# EAGLE design cypress-breakout_DL_v2 (EAGLE 6.1)
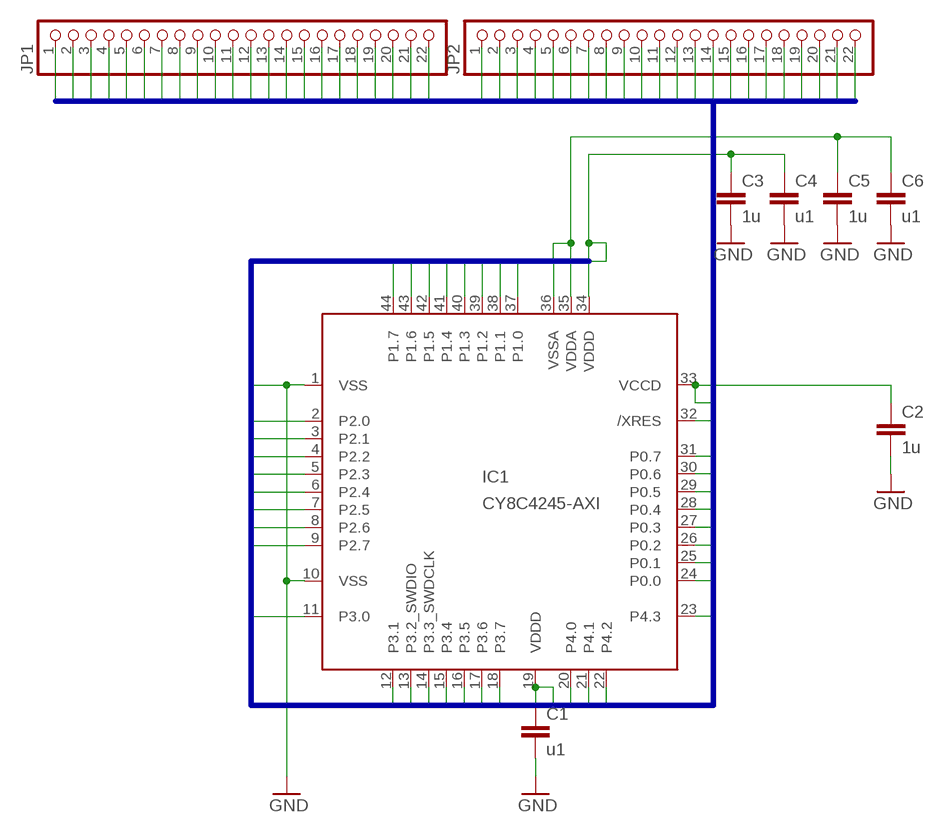
[diagram p0: schematic, sheet 1]

## Parts
C1  u1  C-EUC0805K  [C0805K]
C2  1u  C-EUC0805K  [C0805K]
C3  1u  C-EUC0805K  [C0805K]
C4  u1  C-EUC0805K  [C0805K]
C5  1u  C-EUC0805K  [C0805K]
C6  u1  C-EUC0805K  [C0805K]
IC1  CY8C4245-AXI  [44-TQFP-0.8]
JP1  PINHD-1X22  [1X22]
JP2  PINHD-1X22  [1X22]

## Nets
#XRES: IC1.32(/XRES) JP2.10
GND: C1.2 C2.2 C3.2 C4.2 C5.2 C6.2
P0.0: IC1.24(P0.0) JP2.2
P0.1: IC1.25(P0.1) JP2.3
P0.2: IC1.26(P0.2) JP2.4
P0.3: IC1.27(P0.3) JP2.5
P0.4: IC1.28(P0.4) JP2.6
P0.5: IC1.29(P0.5) JP2.7
P0.6: IC1.30(P0.6) JP2.8
P0.7: IC1.31(P0.7) JP2.9
P1.0: IC1.37(P1.0) JP2.15
P1.1: IC1.38(P1.1) JP2.16
P1.2: IC1.39(P1.2) JP2.17
P1.3: IC1.40(P1.3) JP2.18
P1.4: IC1.41(P1.4) JP2.19
P1.5: IC1.42(P1.5) JP2.20
P1.6: IC1.43(P1.6) JP2.21
P1.7: IC1.44(P1.7) JP2.22
P2.0: IC1.2(P2.0) JP1.2
P2.1: IC1.3(P2.1) JP1.3
P2.2: IC1.4(P2.2) JP1.4
P2.3: IC1.5(P2.3) JP1.5
P2.4: IC1.6(P2.4) JP1.6
P2.5: IC1.7(P2.5) JP1.7
P2.6: IC1.8(P2.6) JP1.8
P2.7: IC1.9(P2.7) JP1.9
P3.0: IC1.11(P3.0) JP1.11
P3.1: IC1.12(P3.1) JP1.12
P3.2: IC1.13(P3.2_SWDIO) JP1.13
P3.3: IC1.14(P3.3_SWDCLK) JP1.14
P3.4: IC1.15(P3.4) JP1.15
P3.5: IC1.16(P3.5) JP1.16
P3.6: IC1.17(P3.6) JP1.17
P3.7: IC1.18(P3.7) JP1.18
P4.0: IC1.20(P4.0) JP1.20
P4.1: IC1.21(P4.1) JP1.21
P4.2: IC1.22(P4.2) JP1.22
P4.3: IC1.23(P4.3) JP2.1
VCCD: C2.1 IC1.33(VCCD) JP2.11
VDDA: C5.1 C6.1 IC1.35(VDDA) JP2.13
VDDD: C1.1 C3.1 C4.1 IC1.19(VDDD) IC1.34(VDDD) JP1.19 JP2.12
VSS: IC1.1(VSS) IC1.10(VSS) JP1.1 JP1.10 ; supply symbol labelled GND
VSSA: IC1.36(VSSA) JP2.14

## Buses
P0.[0..7],P1.[0..7],P2.[0..7],P3.[0..7],P4.[0..3],VSS,VDDD,#XRES,VSSA,VDDA,VCCD

## Library data of the parts
C1-C6 = rcl:C-EU: CAPACITOR, European symbol
IC1 = CY8C4200:CY8C4245: PSOC4200 in TQFP-44 Source:
JP1 JP2 = pinhead:PINHD-1X22: PIN HEADER

## Board
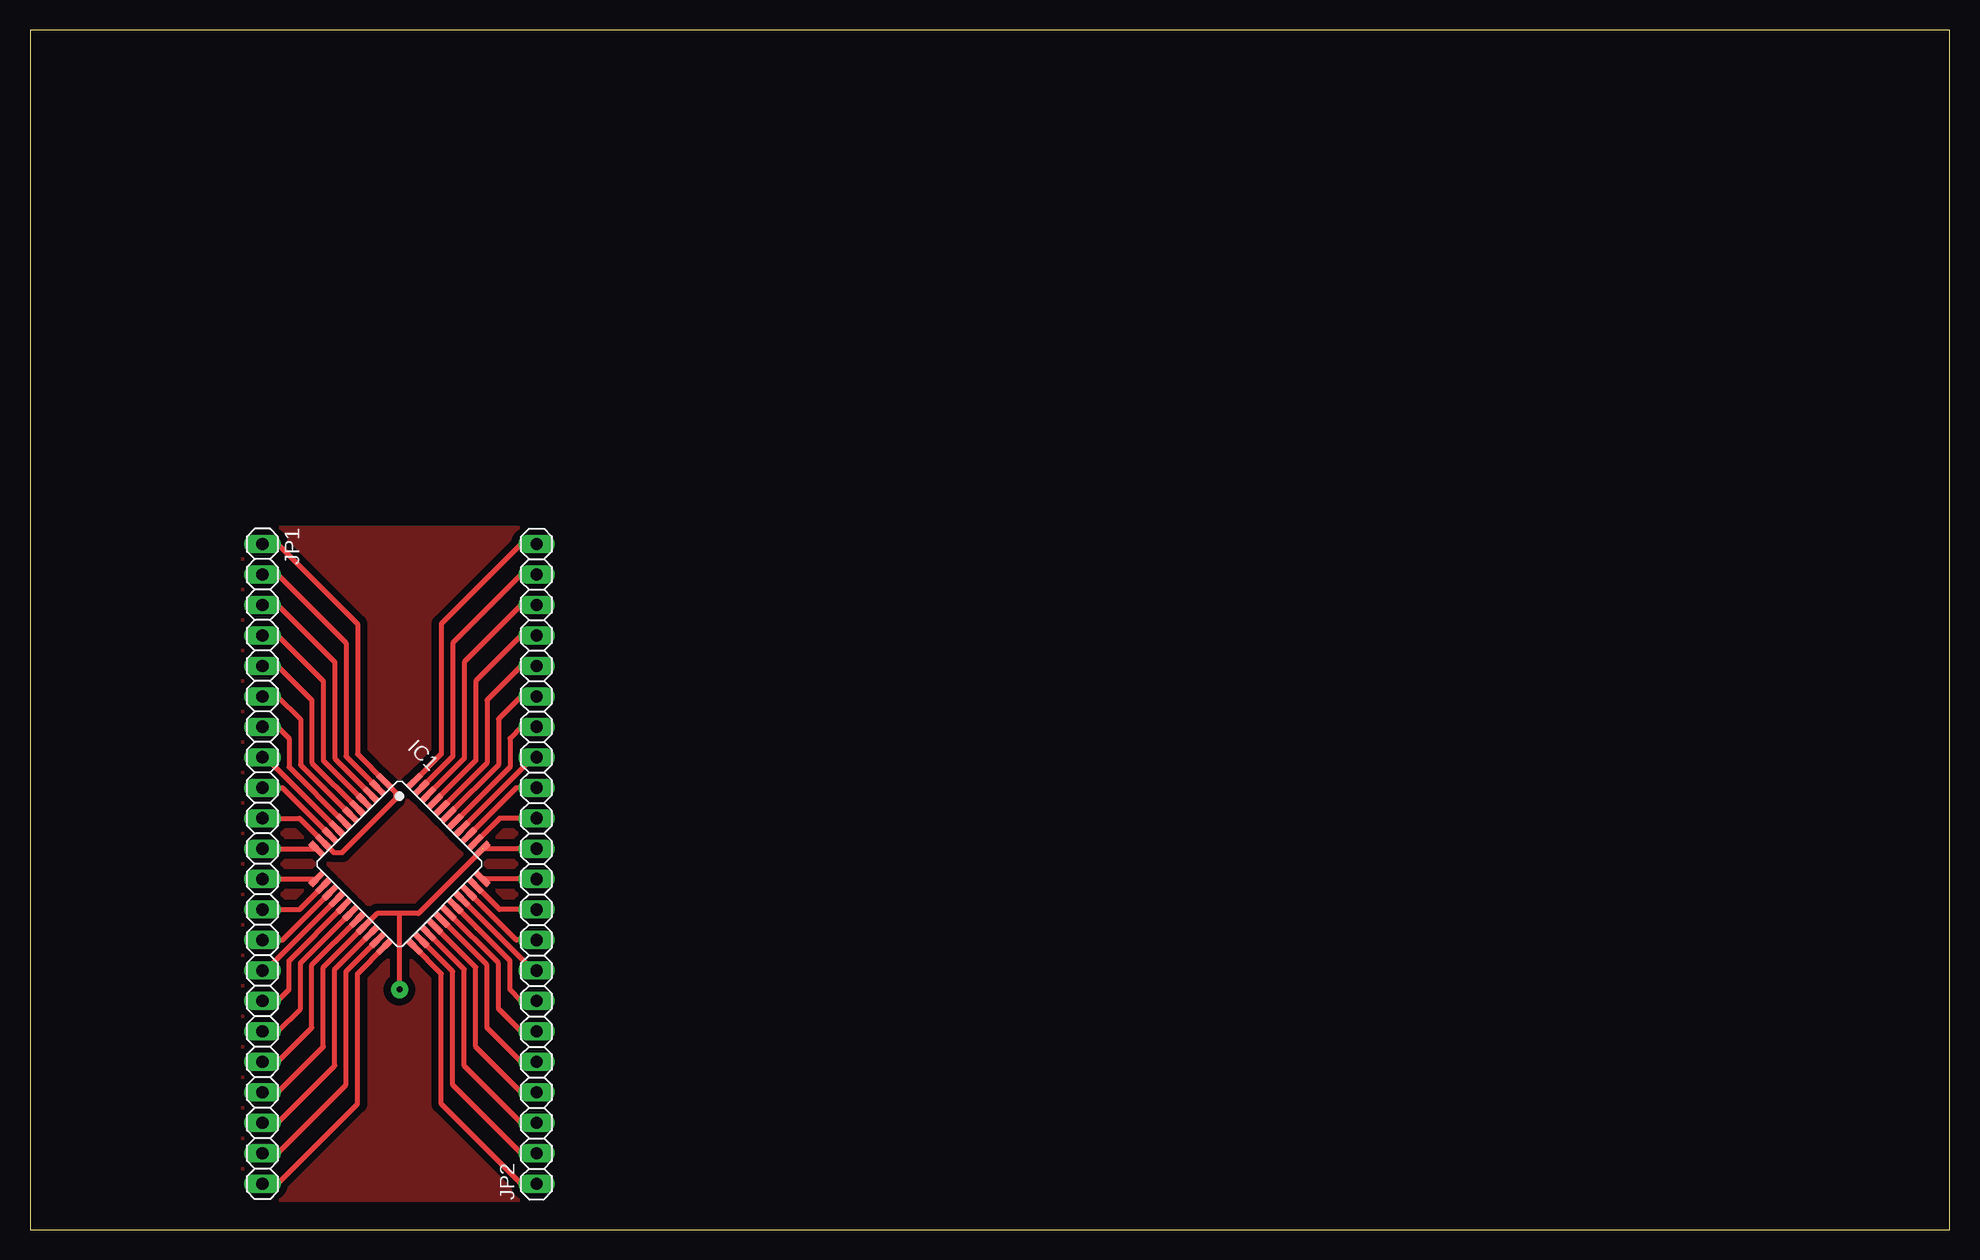
[diagram p1: board, top side]
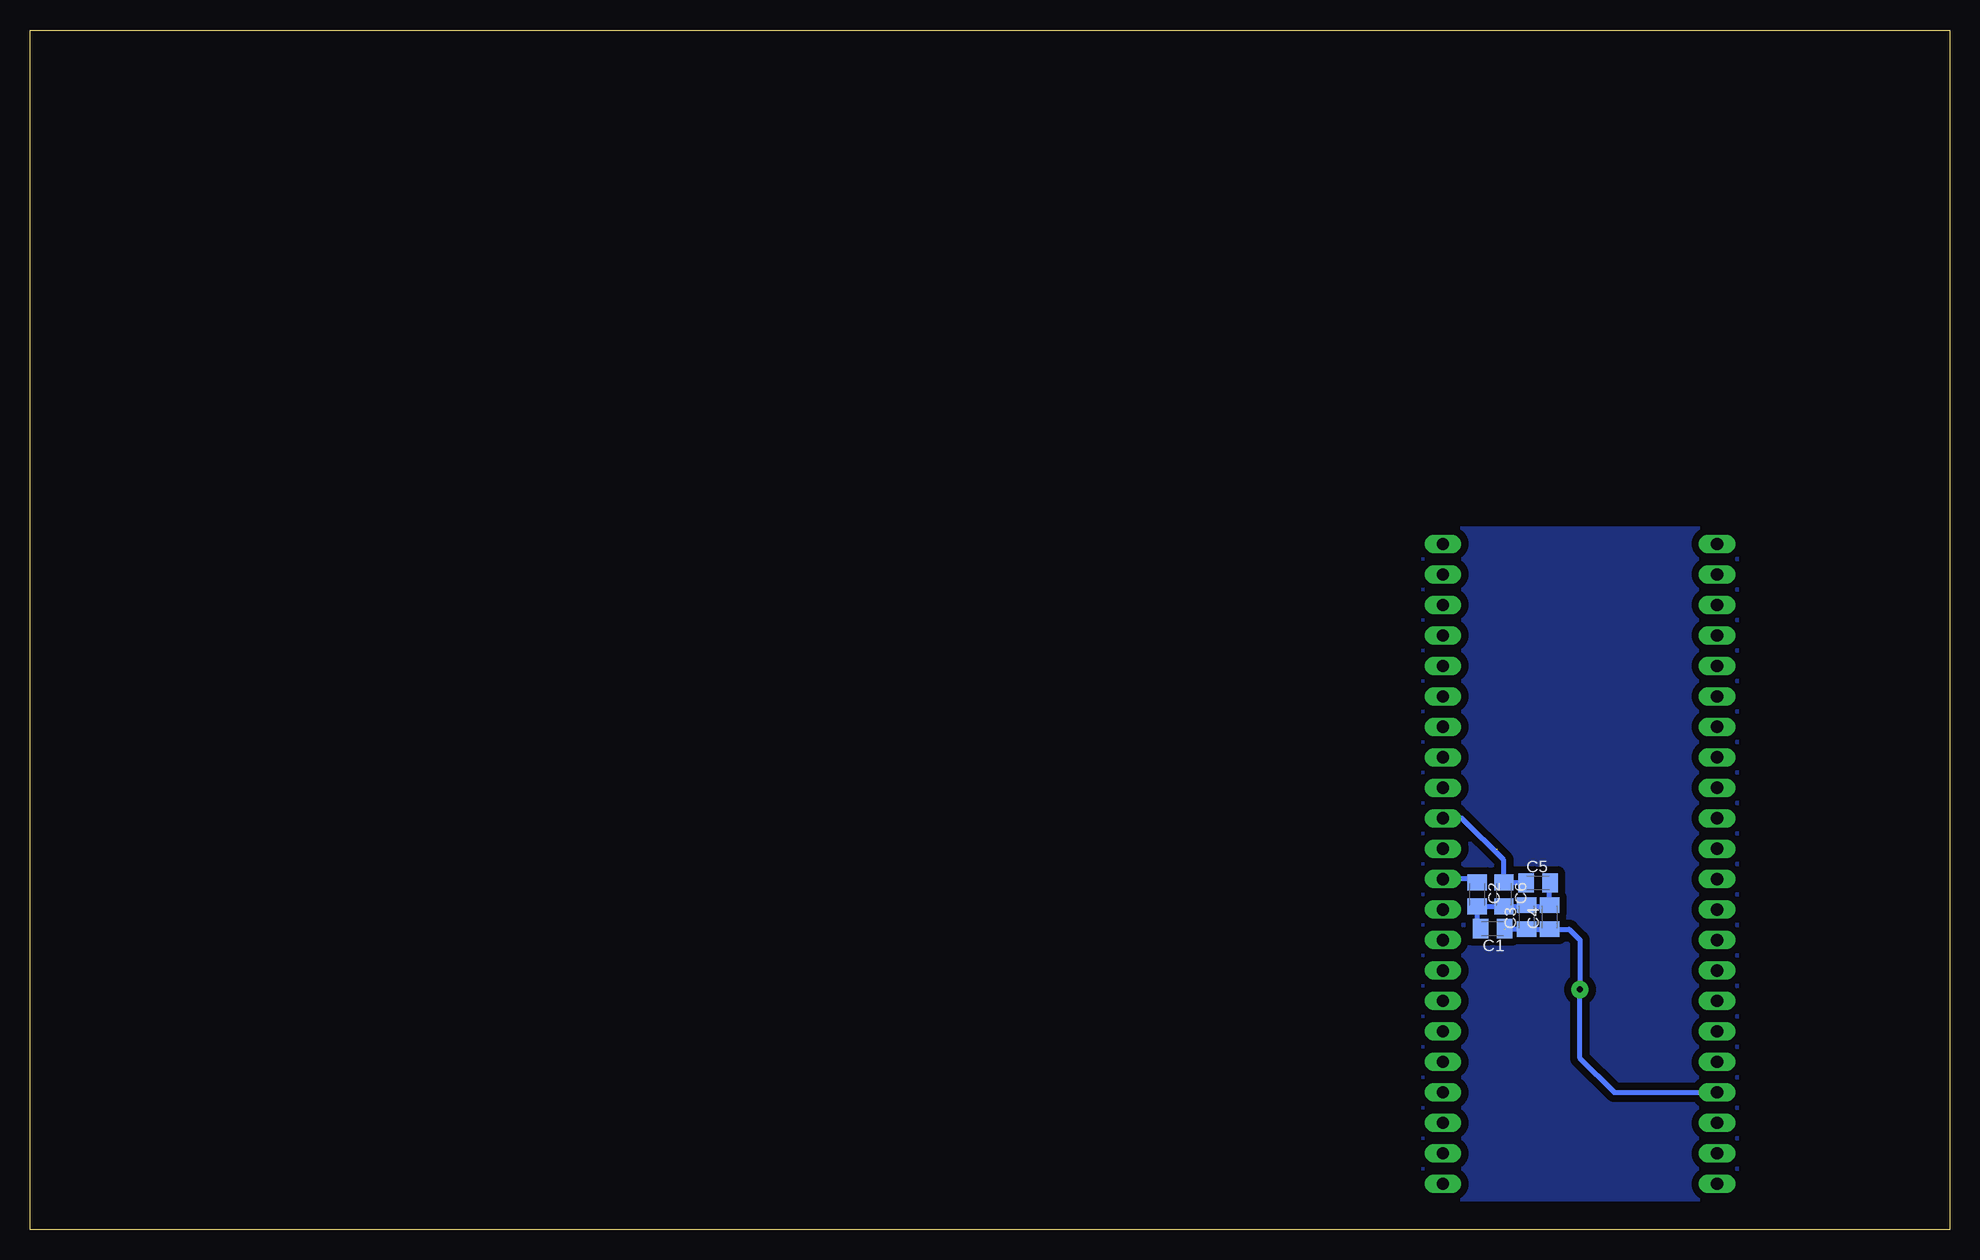
[diagram p2: board, bottom side, seen from below]

Size 160 x 100 mm. Coordinates in mm from the lower left corner, seen from the top.
Outline: 0,0 160,0 160,100 0,100 0,0
Copper layers (1*16): Top 0.035mm / dielectric 1.5mm / Bottom 0.035mm
Design rules: minimum track width 10mil, minimum drill 24mil, track to track 12mil, track to pad 12mil, pad to pad 12mil, via to via 12mil, smd to smd 10mil, copper to edge 12mil, drill to drill 12mil, minimum pad ring 10mil, minimum via ring 10mil, stop-mask expansion 4mil, vias tented up to drill 0mil, thermal gap 12mil

### Footprints (pad centres in the part's own frame; a part is rotated, then mirrored left to right if it is on the bottom)
C0805K = smd 1.3 x 1.6: 1 -1,0; 2 1,0
44-TQFP-0.8 = smd 1.5 x 0.5: 1 -5.75,4; 2 -5.75,3.2; 3 -5.75,2.4; 4 -5.75,1.6; 5 -5.75,0.8; 6 -5.75,0; 7 -5.75,-0.8; 8 -5.75,-1.6; 9 -5.75,-2.4; 10 -5.75,-3.2; 11 -5.75,-4; 23 5.75,-4; 24 5.75,-3.2; 25 5.75,-2.4; 26 5.75,-1.6; 27 5.75,-0.8; 28 5.75,0; 29 5.75,0.8; 30 5.75,1.6; 31 5.75,2.4; 32 5.75,3.2; 33 5.75,4 | smd 0.5 x 1.5: 12 -4,-5.75; 13 -3.2,-5.75; 14 -2.4,-5.75; 15 -1.6,-5.75; 16 -0.8,-5.75; 17 0,-5.75; 18 0.8,-5.75; 19 1.6,-5.75; 20 2.4,-5.75; 21 3.2,-5.75; 22 4,-5.75; 34 4,5.75; 35 3.2,5.75; 36 2.4,5.75; 37 1.6,5.75; 38 0.8,5.75; 39 0,5.75; 40 -0.8,5.75; 41 -1.6,5.75; 42 -2.4,5.75; 43 -3.2,5.75; 44 -4,5.75
1X22 = drill 1.016 long: 1 -26.67,0; 2 -24.13,0; 3 -21.59,0; 4 -19.05,0; 5 -16.51,0; 6 -13.97,0; 7 -11.43,0; 8 -8.89,0; 9 -6.35,0; 10 -3.81,0; 11 -1.27,0; 12 1.27,0; 13 3.81,0; 14 6.35,0; 15 8.89,0; 16 11.43,0; 17 13.97,0; 18 16.51,0; 19 19.05,0; 20 21.59,0; 21 24.13,0; 22 26.67,0

### Placement (x,y rotation side)
C1  38.1,25.08 180 bottom
C2  39.37,27.94 270 bottom
C3  35.24,26.04 90 bottom
C4  33.34,26.04 90 bottom
C5  34.29,28.89 0 bottom
C6  37.15,27.94 270 bottom
IC1  30.8,30.48 315 top
JP1  19.37,30.48 270 top
JP2  42.23,30.48 90 top

### Tracks (layer width: path | path; a pad name or v marks a point on that pad's centre or on a via)
#XRES
  Top 0.406: JP2.10 39.13,26.67 IC1.32
GND
  Bottom 0.406: 34.92,26.94 C6.2 C2.2 39.37,25.4 39.1,25.13 C1.2 | 34.92,26.94 34.02,26.94 33.34,27.62 | 33.34,27.62 33.34,28.84 C5.2 | C4.2 33.34,27.62 | C3.2 35.02,27.04 34.92,26.94
N$1
  pour Top (isolate 0.61, no thermals): 17.78,2.54 43.81,2.54 43.81,58.42 17.78,58.42
N$2
  pour Bottom (isolate 0.61, no thermals): 17.78,2.54 43.81,2.54 43.81,58.42 17.78,58.42
P0.0
  Top 0.406: JP2.2 40.96,6.35 35.24,12.06 35.24,21.51 IC1.24
P0.1
  Top 0.406: JP2.3 40.96,8.89 36.2,13.65 36.2,21.69 IC1.25
P0.2
  Top 0.406: JP2.4 40.96,11.43 37.15,15.24 37.15,21.87 IC1.26
P0.3
  Top 0.406: JP2.5 40.96,13.97 38.1,16.83 38.1,22.05 IC1.27
P0.4
  Top 0.406: JP2.6 40.96,16.51 39.05,18.41 39.05,22.23 IC1.28
P0.5
  Top 0.406: JP2.7 40.96,19.05 40.01,20 40.01,22.4 IC1.29
P0.6
  Top 0.406: JP2.8 41.95,21.59 IC1.30
P0.7
  Top 0.406: JP2.9 40.54,24.13 IC1.31
P1.0
  Top 0.406: JP2.15 41.95,39.37 IC1.37
P1.1
  Top 0.406: JP2.16 40.96,41.91 40.01,40.96 40.01,38.56 IC1.38
P1.2
  Top 0.406: JP2.17 40.96,44.45 39.05,42.55 39.05,38.73 IC1.39
P1.3
  Top 0.406: JP2.18 40.96,46.99 38.1,44.13 38.1,38.91 IC1.40
P1.4
  Top 0.406: JP2.19 40.96,49.53 37.15,45.72 37.15,39.09 IC1.41
P1.5
  Top 0.406: JP2.20 40.96,52.07 36.2,47.31 36.2,39.27 IC1.42
P1.6
  Top 0.406: JP2.21 40.96,54.61 35.24,48.9 35.24,39.45 IC1.43
P1.7
  Top 0.406: JP2.22 40.96,57.15 34.29,50.48 34.29,39.63 IC1.44
P2.0
  Top 0.406: JP1.2 20.64,54.61 26.35,48.9 26.35,39.45 IC1.2
P2.1
  Top 0.406: JP1.3 20.64,52.07 25.4,47.31 25.4,39.27 IC1.3
P2.2
  Top 0.406: JP1.4 20.64,49.53 24.45,45.72 24.45,39.09 IC1.4
P2.3
  Top 0.406: JP1.5 20.64,46.99 23.5,44.13 23.5,38.91 IC1.5
P2.4
  Top 0.406: JP1.6 20.64,44.45 22.54,42.55 22.54,38.73 IC1.6
P2.5
  Top 0.406: JP1.7 20.64,41.91 21.59,40.96 21.59,38.56 IC1.7
P2.6
  Top 0.406: JP1.8 19.64,39.37 IC1.8
P2.7
  Top 0.406: JP1.9 21.05,36.83 IC1.9
P3.0
  Top 0.406: JP1.11 23.87,31.75 IC1.11
P3.1
  Top 0.406: JP1.12 23.87,29.21 IC1.12
P3.2
  Top 0.406: JP1.13 22.46,26.67 IC1.13
P3.3
  Top 0.406: JP1.14 21.05,24.13 IC1.14
P3.4
  Top 0.406: JP1.15 19.64,21.59 IC1.15
P3.5
  Top 0.406: JP1.16 20.64,19.05 21.59,20 21.59,22.4 IC1.16
P3.6
  Top 0.406: JP1.17 20.64,16.51 22.54,18.41 22.54,22.23 IC1.17
P3.7
  Top 0.406: JP1.18 20.64,13.97 23.5,16.83 23.5,22.05 IC1.18
P4.0
  Top 0.406: JP1.20 20.64,8.89 25.4,13.65 25.4,21.69 IC1.20
P4.1
  Top 0.406: JP1.21 20.64,6.35 26.35,12.06 26.35,21.51 IC1.21
P4.2
  Top 0.406: JP1.22 20.64,3.81 27.3,10.48 27.3,21.33 IC1.22
P4.3
  Top 0.406: JP2.1 40.96,3.81 34.29,10.48 34.29,21.33 IC1.23
VCCD
  Top 0.406: JP2.11 37.72,29.21 IC1.33
  Bottom 0.406: C2.1 39.37,29.21 JP2.11
VDDA
  Top 0.406: JP2.13 39.13,34.29 IC1.35
  Bottom 0.406: C5.1 37.1,28.89 C6.1 37.15,30.8 40.64,34.29 JP2.13
VDDD  (via drill 0.5 pad 1.42)  (2 unrouted)
  Top 0.406: JP2.12 37.78,31.75 32.38,26.35 30.8,26.35 | JP1.19 20.64,11.43 24.45,15.24 24.45,21.87 IC1.19 28.93,26.35 30.8,26.35 | v30.8,20 30.8,26.35
  Bottom 0.406: JP1.19 27.94,11.43 30.8,14.29 v30.8,20 30.8,24.13 31.7,25.04 C4.1 C3.1 37.1,25.04 37.15,25.08
VSS
  Top 0.406: JP1.10 22.46,34.29 IC1.10 25.32,31.43 26.04,31.43 30.48,35.88 30.48,36.45 IC1.1 27.3,39.63 27.3,50.48 20.64,57.15 JP1.1
VSSA
  Top 0.406: JP2.14 40.54,36.83 IC1.36